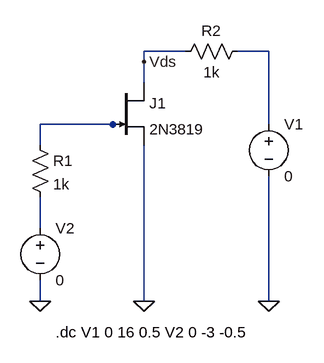
[diagram p0: schematic jfet op characteristics.asc]
jfet op characteristics.asc, the LTspice schematic file:
Version 4
SHEET 1 880 680
WIRE 288 80 224 80
WIRE 416 80 368 80
WIRE 224 96 224 80
WIRE 224 128 224 96
WIRE 176 192 64 192
WIRE 192 192 176 192
WIRE 416 192 416 80
WIRE 64 224 64 192
WIRE 64 352 64 304
WIRE 64 464 64 432
WIRE 224 464 224 224
WIRE 416 464 416 272
FLAG 64 464 0
FLAG 224 464 0
FLAG 416 464 0
FLAG 224 96 Vds
SYMBOL njf 176 128 R0
SYMATTR InstName J1
SYMATTR Value 2N3819
SYMBOL voltage 416 176 R0
WINDOW 123 0 0 Left 0
WINDOW 39 0 0 Left 0
SYMATTR InstName V1
SYMATTR Value 0
SYMBOL voltage 64 336 R0
WINDOW 123 0 0 Left 0
WINDOW 39 0 0 Left 0
SYMATTR InstName V2
SYMATTR Value 0
SYMBOL res 48 208 R0
SYMATTR InstName R1
SYMATTR Value 1k
SYMBOL res 384 64 R90
WINDOW 0 0 56 VBottom 2
WINDOW 3 32 56 VTop 2
SYMATTR InstName R2
SYMATTR Value 1k
TEXT 88 512 Left 2 !.dc V1 0 16 0.5 V2 0 -3 -0.5

The netlist it stands for:
* jfet op characteristics.asc
J1 Vds N002 0 2N3819
V1 N001 0 0
V2 N003 0 0
R1 N002 N003 1k
R2 N001 Vds 1k
.model NJF NJF
.model PJF PJF
.lib standard.jft
.dc V1 0 16 0.5 V2 0 -3 -0.5
.backanno
.end